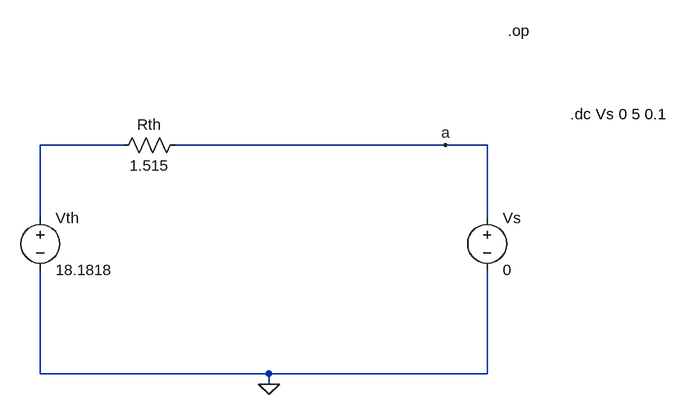
[diagram p0: schematic Schematic3.asc]
Schematic3.asc, the LTspice schematic file:
Version 4
SHEET 1 932 680
WIRE 48 0 -80 0
WIRE 544 0 128 0
WIRE 608 0 544 0
WIRE -80 112 -80 0
WIRE 608 112 608 0
WIRE -80 352 -80 192
WIRE 272 352 -80 352
WIRE 608 352 608 192
WIRE 608 352 272 352
WIRE 272 368 272 352
FLAG 544 0 a
FLAG 272 368 0
SYMBOL voltage 608 96 R0
SYMATTR InstName Vs
SYMATTR Value 0
SYMBOL voltage -80 96 R0
WINDOW 123 0 0 Left 0
WINDOW 39 0 0 Left 0
SYMATTR InstName Vth
SYMATTR Value 18.1818
SYMBOL res 144 -16 R90
WINDOW 0 0 56 VBottom 2
WINDOW 3 32 56 VTop 2
SYMATTR InstName Rth
SYMATTR Value 1.515
TEXT 640 -176 Left 2 !.op
TEXT 736 -48 Left 2 !.dc Vs 0 5 0.1

The netlist it stands for:
* Schematic3.asc
Vs a 0 0
Vth N001 0 18.1818
Rth a N001 1.515
.op
.dc Vs 0 5 0.1
.backanno
.end

* Results of the author's LTspice run, read from the files saved beside the schematic
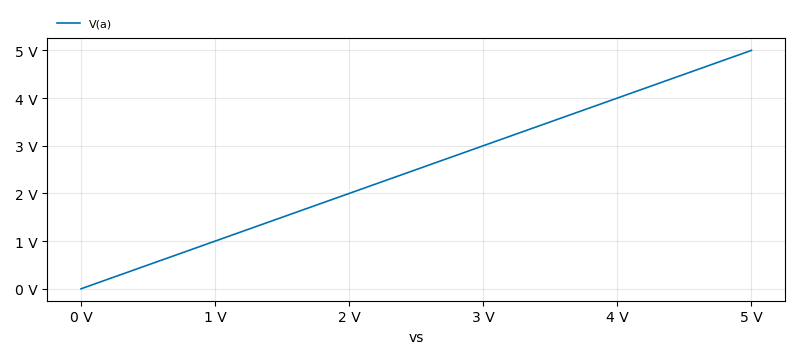
[diagram p1: DC transfer characteristic of Schematic3.asc, plotted from the saved traces]
* DC transfer characteristic, 1 run:
*   V(a): 0 V at vs=0 V, 5 V at vs=5 V, min 0 V, max 5 V